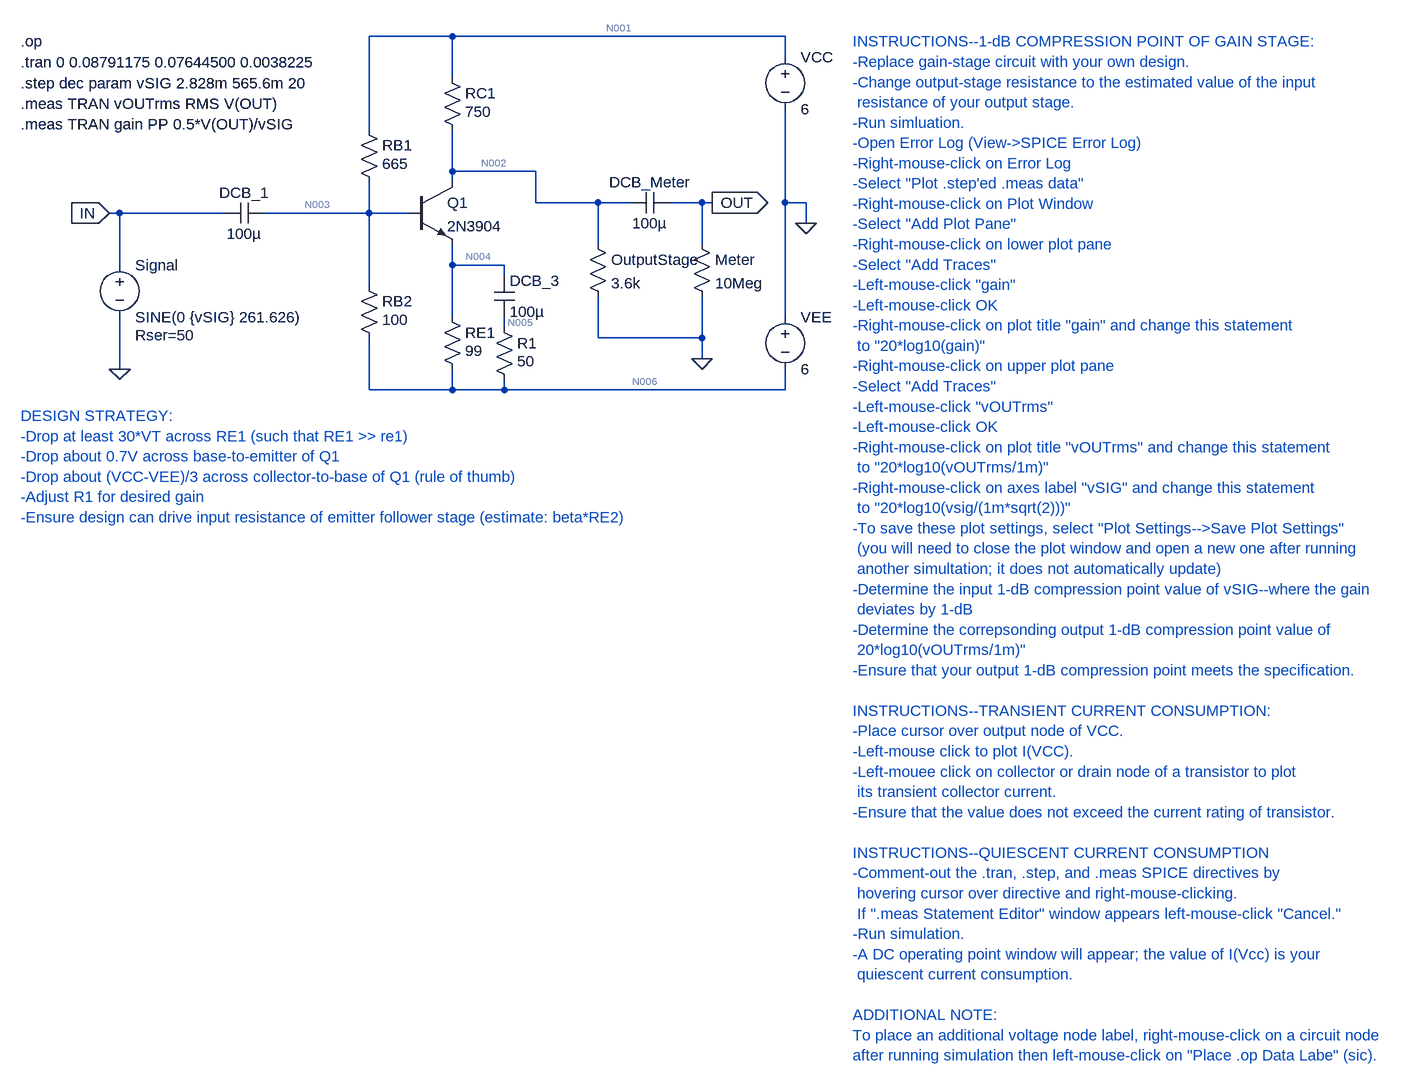
[diagram p0: schematic VoltageGainStage (1).asc]
VoltageGainStage (1).asc, the LTspice schematic file:
Version 4
SHEET 1 2440 1204
WIRE 192 -304 64 -304
WIRE 704 -304 192 -304
WIRE 704 -272 704 -304
WIRE 192 -240 192 -304
WIRE 64 -160 64 -304
WIRE 192 -96 192 -160
WIRE 320 -96 192 -96
WIRE 192 -80 192 -96
WIRE 320 -48 320 -96
WIRE 416 -48 320 -48
WIRE 464 -48 416 -48
WIRE 576 -48 528 -48
WIRE 592 -48 576 -48
WIRE 704 -48 704 -192
WIRE 736 -48 704 -48
WIRE -320 -32 -336 -32
WIRE -160 -32 -320 -32
WIRE 64 -32 64 -80
WIRE 64 -32 -96 -32
WIRE 128 -32 64 -32
WIRE 736 -16 736 -48
WIRE 416 16 416 -48
WIRE 576 16 576 -48
WIRE -320 48 -320 -32
WIRE 192 48 192 16
WIRE 272 48 192 48
WIRE 272 64 272 48
WIRE 64 80 64 -32
WIRE 192 128 192 48
WIRE 704 128 704 -48
WIRE 272 144 272 128
WIRE 416 160 416 96
WIRE 576 160 576 96
WIRE 576 160 416 160
WIRE 576 192 576 160
WIRE -320 208 -320 128
WIRE 64 240 64 160
WIRE 192 240 192 208
WIRE 192 240 64 240
WIRE 272 240 272 224
WIRE 272 240 192 240
WIRE 704 240 704 208
WIRE 704 240 272 240
FLAG -320 208 0
FLAG 592 -48 OUT
IOPIN 592 -48 Out
FLAG -336 -32 IN
IOPIN -336 -32 In
FLAG 736 -16 0
FLAG 576 192 0
DATAFLAG 272 48 "$-V(n006)"
DATAFLAG 96 -32 "$-V(n004)"
DATAFLAG 320 -96 "$-V(n003)"
DATAFLAG 192 -288 "Ic(Q1)"
DATAFLAG 192 240 "Ib(Q1)"
DATAFLAG 560 -48 "V(out)"
SYMBOL voltage 704 -288 R0
WINDOW 123 0 0 Left 0
WINDOW 39 0 0 Left 0
SYMATTR InstName VCC
SYMATTR Value 6
SYMBOL res 48 -176 R0
WINDOW 3 36 68 Left 2
SYMATTR Value 665
SYMATTR InstName RB1
SYMBOL res 48 64 R0
WINDOW 3 36 68 Left 2
SYMATTR Value 100
SYMATTR InstName RB2
SYMBOL res 560 0 R0
SYMATTR InstName Meter
SYMATTR Value 10Meg
SYMBOL voltage -320 32 R0
WINDOW 123 0 0 Left 2
WINDOW 39 24 124 Left 2
SYMATTR SpiceLine Rser=50
SYMATTR InstName Signal
SYMATTR Value SINE(0 {vSIG} 261.626)
SYMBOL cap 528 -64 R90
WINDOW 0 0 32 VBottom 2
WINDOW 3 32 32 VTop 2
SYMATTR InstName DCB_Meter
SYMATTR Value 100µ
SYMBOL cap -96 -48 R90
WINDOW 0 0 32 VBottom 2
WINDOW 3 32 32 VTop 2
SYMATTR InstName DCB_1
SYMATTR Value 100µ
SYMBOL res 176 112 R0
WINDOW 3 36 68 Left 2
SYMATTR Value 99
SYMATTR InstName RE1
SYMBOL res 256 128 R0
WINDOW 3 36 68 Left 2
SYMATTR Value 50
SYMATTR InstName R1
SYMBOL cap 256 64 R0
SYMATTR InstName DCB_3
SYMATTR Value 100µ
SYMBOL res 176 -256 R0
WINDOW 3 36 68 Left 2
SYMATTR Value 750
SYMATTR InstName RC1
SYMBOL npn 128 -80 R0
SYMATTR InstName Q1
SYMATTR Value 2N3904
SYMBOL res 400 0 R0
SYMATTR InstName OutputStage
SYMATTR Value 3.6k
SYMBOL voltage 704 112 R0
WINDOW 123 0 0 Left 0
WINDOW 39 0 0 Left 0
SYMATTR InstName VEE
SYMATTR Value 6
TEXT -472 -232 Left 2 !.step dec param vSIG 2.828m 565.6m 20
TEXT -472 -264 Left 2 !.tran 0 0.08791175 0.07644500 0.0038225
TEXT -472 -200 Left 2 !.meas TRAN vOUTrms RMS V(OUT)\n.meas TRAN gain PP 0.5*V(OUT)/vSIG
TEXT -472 -296 Left 2 !.op
TEXT 808 -296 Left 2 ;INSTRUCTIONS--1-dB COMPRESSION POINT OF GAIN STAGE:\n-Replace gain-stage circuit with your own design.\n-Change output-stage resistance to the estimated value of the input \n resistance of your output stage.\n-Run simluation.\n-Open Error Log (View->SPICE Error Log)\n-Right-mouse-click on Error Log\n-Select "Plot .step'ed .meas data"\n-Right-mouse-click on Plot Window\n-Select "Add Plot Pane"\n-Right-mouse-click on lower plot pane\n-Select "Add Traces"\n-Left-mouse-click "gain"\n-Left-mouse-click OK\n-Right-mouse-click on plot title "gain" and change this statement\n to "20*log10(gain)"\n-Right-mouse-click on upper plot pane\n-Select "Add Traces"\n-Left-mouse-click "vOUTrms"\n-Left-mouse-click OK\n-Right-mouse-click on plot title "vOUTrms" and change this statement\n to "20*log10(vOUTrms/1m)"\n-Right-mouse-click on axes label "vSIG" and change this statement\n to "20*log10(vsig/(1m*sqrt(2)))"\n-To save these plot settings, select "Plot Settings-->Save Plot Settings"\n (you will need to close the plot window and open a new one after running \n another simultation; it does not automatically update)\n-Determine the input 1-dB compression point value of vSIG--where the gain\n deviates by 1-dB\n-Determine the correpsonding output 1-dB compression point value of \n 20*log10(vOUTrms/1m)"\n-Ensure that your output 1-dB compression point meets the specification.\n \nINSTRUCTIONS--TRANSIENT CURRENT CONSUMPTION:\n-Place cursor over output node of VCC.\n-Left-mouse click to plot I(VCC).\n-Left-mouee click on collector or drain node of a transistor to plot \n its transient collector current.\n-Ensure that the value does not exceed the current rating of transistor.\n \nINSTRUCTIONS--QUIESCENT CURRENT CONSUMPTION\n-Comment-out the .tran, .step, and .meas SPICE directives by \n hovering cursor over directive and right-mouse-clicking.\n If ".meas Statement Editor" window appears left-mouse-click "Cancel."\n-Run simulation.\n-A DC operating point window will appear; the value of I(Vcc) is your \n quiescent current consumption.\n \nADDITIONAL NOTE:\nTo place an additional voltage node label, right-mouse-click on a circuit node\nafter running simulation then left-mouse-click on "Place .op Data Labe" (sic).
TEXT -472 280 Left 2 ;DESIGN STRATEGY:\n-Drop at least 30*VT across RE1 (such that RE1 >> re1)\n-Drop about 0.7V across base-to-emitter of Q1\n-Drop about (VCC-VEE)/3 across collector-to-base of Q1 (rule of thumb)\n-Adjust R1 for desired gain\n-Ensure design can drive input resistance of emitter follower stage (estimate: beta*RE2)

The netlist it stands for:
* VoltageGainStage (1).asc
VCC N001 0 6
RB1 N001 N003 665
RB2 N003 N006 100
R§Meter OUT 0 10Meg
V§Signal IN 0 SINE(0 {vSIG} 261.626) Rser=50
C§DCB_Meter OUT N002 100µ
C§DCB_1 N003 IN 100µ
RE1 N004 N006 99
R1 N005 N006 50
C§DCB_3 N004 N005 100µ
RC1 N001 N002 750
Q1 N002 N003 N004 0 2N3904
R§OutputStage N002 0 3.6k
VEE 0 N006 6
.model NPN NPN
.model PNP PNP
.lib standard.bjt
.step dec param vSIG 2.828m 565.6m 20
.tran 0 0.08791175 0.07644500 0.0038225
.meas TRAN vOUTrms RMS V(OUT)
.meas TRAN gain PP 0.5*V(OUT)/vSIG
.op
* INSTRUCTIONS--1-dB COMPRESSION POINT OF GAIN STAGE:
* -Replace gain-stage circuit with your own design.
* -Change output-stage resistance to the estimated value of the input
*  resistance of your output stage.
* -Run simluation.
* -Open Error Log (View->SPICE Error Log)
* -Right-mouse-click on Error Log
* -Select "Plot .step'ed .meas data"
* -Right-mouse-click on Plot Window
* -Select "Add Plot Pane"
* -Right-mouse-click on lower plot pane
* -Select "Add Traces"
* -Left-mouse-click "gain"
* -Left-mouse-click OK
* -Right-mouse-click on plot title "gain" and change this statement
*  to "20*log10(gain)"
* -Right-mouse-click on upper plot pane
* -Select "Add Traces"
* -Left-mouse-click "vOUTrms"
* -Left-mouse-click OK
* -Right-mouse-click on plot title "vOUTrms" and change this statement
*  to "20*log10(vOUTrms/1m)"
* -Right-mouse-click on axes label "vSIG" and change this statement
*  to "20*log10(vsig/(1m*sqrt(2)))"
* -To save these plot settings, select "Plot Settings-->Save Plot Settings"
*  (you will need to close the plot window and open a new one after running
*  another simultation; it does not automatically update)
* -Determine the input 1-dB compression point value of vSIG--where the gain
*  deviates by 1-dB
* -Determine the correpsonding output 1-dB compression point value of
*  20*log10(vOUTrms/1m)"
* -Ensure that your output 1-dB compression point meets the specification.
* INSTRUCTIONS--TRANSIENT CURRENT CONSUMPTION:
* -Place cursor over output node of VCC.
* -Left-mouse click to plot I(VCC).
* -Left-mouee click on collector or drain node of a transistor to plot
*  its transient collector current.
* -Ensure that the value does not exceed the current rating of transistor.
* INSTRUCTIONS--QUIESCENT CURRENT CONSUMPTION
* -Comment-out the .tran, .step, and .meas SPICE directives by
*  hovering cursor over directive and right-mouse-clicking.
*  If ".meas Statement Editor" window appears left-mouse-click "Cancel."
* -Run simulation.
* -A DC operating point window will appear; the value of I(Vcc) is your
*  quiescent current consumption.
* ADDITIONAL NOTE:
* To place an additional voltage node label, right-mouse-click on a circuit node
* after running simulation then left-mouse-click on "Place .op Data Labe" (sic).
* DESIGN STRATEGY:
* -Drop at least 30*VT across RE1 (such that RE1 >> re1)
* -Drop about 0.7V across base-to-emitter of Q1
* -Drop about (VCC-VEE)/3 across collector-to-base of Q1 (rule of thumb)
* -Adjust R1 for desired gain
* -Ensure design can drive input resistance of emitter follower stage (estimate: beta*RE2)
.backanno
.end

* Results of the author's LTspice run, read from the files saved beside the schematic
* Operating Point (first step), zero values left out:
*   vsig = 2.828 m
*   V(n001) = 6 V
*   V(n003) = -4.434 V
*   V(n006) = -6 V
*   V(n002) = -374.2 mV
*   V(n004) = -5.146 V
*   V(n005) = -6 V
*   Ic(Q1) = 8.603 mA
*   Ib(Q1) = 28.13 µA
*   Ie(Q1) = -8.631 mA
*   I(Outputstage) = -104 µA
*   I(Rc1) = 8.499 mA
*   I(Re1) = 8.631 mA
*   I(Rb2) = 15.66 mA
*   I(Rb1) = 15.69 mA
*   I(Vee) = -24.29 mA
*   I(Vcc) = -24.19 mA
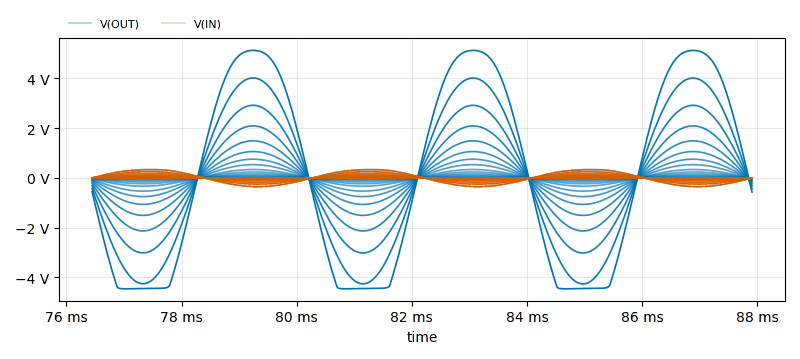
[diagram p1: Transient Analysis of VoltageGainStage (1).asc, plotted from the saved traces]
* Transient Analysis, 48 runs:
*   V(OUT) [run 1]: min -29.99 mV, max 30.01 mV, average 14.95 µV, rms 21.21 mV, last -3.507 mV
*   V(OUT) [run 2]: min -42.36 mV, max 42.39 mV, average 20.45 µV, rms 29.96 mV, last -4.952 mV
*   V(OUT) [run 3]: min -59.84 mV, max 59.87 mV, average 27.53 µV, rms 42.31 mV, last -6.993 mV
*   V(OUT) [run 4]: min -84.54 mV, max 84.56 mV, average 36.2 µV, rms 59.76 mV, last -9.873 mV
*   V(OUT) [run 5]: min -119.4 mV, max 119.4 mV, average 45.75 µV, rms 84.42 mV, last -13.94 mV
*   V(OUT) [run 6]: min -168.8 mV, max 168.6 mV, average 53.88 µV, rms 119.2 mV, last -19.67 mV
*   V(OUT) [run 7]: min -238.4 mV, max 238.1 mV, average 54.66 µV, rms 168.4 mV, last -27.74 mV
*   V(OUT) [run 8]: min -337 mV, max 336.2 mV, average 34.35 µV, rms 237.9 mV, last -39.11 mV
*   V(IN) [run 1]: min -1.792 mV, max 1.793 mV, average 472.3 nV, rms 1.268 mV, last -46.34 µV
*   V(IN) [run 2]: min -2.531 mV, max 2.533 mV, average 667.1 nV, rms 1.791 mV, last -65.46 µV
*   V(IN) [run 3]: min -3.576 mV, max 3.578 mV, average 942.4 nV, rms 2.529 mV, last -92.46 µV
*   V(IN) [run 4]: min -5.051 mV, max 5.053 mV, average 1.331 µV, rms 3.573 mV, last -130.6 µV
*   V(IN) [run 5]: min -7.134 mV, max 7.138 mV, average 1.88 µV, rms 5.047 mV, last -184.5 µV
*   V(IN) [run 6]: min -10.08 mV, max 10.08 mV, average 2.656 µV, rms 7.129 mV, last -260.5 µV
*   V(IN) [run 7]: min -14.23 mV, max 14.24 mV, average 3.753 µV, rms 10.07 mV, last -368 µV
*   V(IN) [run 8]: min -20.11 mV, max 20.12 mV, average 5.301 µV, rms 14.22 mV, last -519.8 µV
* From the log:
*   Measurement: voutrms
*     step  RMS(v(out))  FROM  TO
*        1  0.0211948  0  0.0114667
*        2  0.023781  0  0.0114667
*        3  0.0266827  0  0.0114667
*        4  0.0299385  0  0.0114667
*        5  0.0335915  0  0.0114667
*        6  0.0376903  0  0.0114667
*        7  0.0422891  0  0.0114667
*        8  0.0474492  0  0.0114667
*        9  0.0532388  0  0.0114667
*       10  0.0597348  0  0.0114667
*       11  0.0670235  0  0.0114667
*       12  0.0752015  0  0.0114667
*       13  0.0843773  0  0.0114667
*       14  0.0946726  0  0.0114667
*       15  0.106224  0  0.0114667
*       16  0.119185  0  0.0114667
*       17  0.133727  0  0.0114667
*       18  0.150043  0  0.0114667
*       19  0.16835  0  0.0114667
*       20  0.18889  0  0.0114667
*       21  0.211935  0  0.0114667
*       22  0.237791  0  0.0114667
*       23  0.266801  0  0.0114667
*       24  0.299348  0  0.0114667
*       25  0.335863  0  0.0114667
*       26  0.37683  0  0.0114667
*       27  0.422789  0  0.0114667
*       28  0.474347  0  0.0114667
*       29  0.532184  0  0.0114667
*       30  0.597061  0  0.0114667
*       31  0.669829  0  0.0114667
*       32  0.75144  0  0.0114667
*       33  0.84296  0  0.0114667
*       34  0.945544  0  0.0114667
*       35  1.0606  0  0.0114667
*       36  1.18953  0  0.0114667
*       37  1.33397  0  0.0114667
*       38  1.49566  0  0.0114667
*       39  1.67663  0  0.0114667
*       40  1.87902  0  0.0114667
*     ...
*   Measurement: gain
*     step  PP(0.5*v(out)/vsig)  FROM  TO
*        1  10.6081  0  0.0114667
*        2  10.6081  0  0.0114667
*        3  10.6081  0  0.0114667
*        4  10.6081  0  0.0114667
*        5  10.6081  0  0.0114667
*        6  10.6081  0  0.0114667
*        7  10.6081  0  0.0114667
*        8  10.6081  0  0.0114667
*        9  10.6081  0  0.0114667
*       10  10.6081  0  0.0114667
*       11  10.6081  0  0.0114667
*       12  10.608  0  0.0114667
*       13  10.608  0  0.0114667
*       14  10.608  0  0.0114667
*       15  10.6079  0  0.0114667
*       16  10.6079  0  0.0114667
*       17  10.6078  0  0.0114667
*       18  10.6077  0  0.0114667
*       19  10.6076  0  0.0114667
*       20  10.6075  0  0.0114667
*       21  10.6073  0  0.0114667
*       22  10.6071  0  0.0114667
*       23  10.6068  0  0.0114667
*       24  10.6065  0  0.0114667
*       25  10.6061  0  0.0114667
*       26  10.6055  0  0.0114667
*       27  10.6048  0  0.0114667
*       28  10.604  0  0.0114667
*       29  10.6029  0  0.0114667
*       30  10.6015  0  0.0114667
*       31  10.5997  0  0.0114667
*       32  10.5975  0  0.0114667
*       33  10.5947  0  0.0114667
*       34  10.5917  0  0.0114667
*       35  10.5865  0  0.0114667
*       36  10.5805  0  0.0114667
*       37  10.5729  0  0.0114667
*       38  10.5636  0  0.0114667
*       39  10.5511  0  0.0114667
*       40  10.5341  0  0.0114667
*     ...